# Altium schematic sheet SMARC Pinout-3.SchDoc
size A4; SheetNumber: 7; SheetTotal: 10
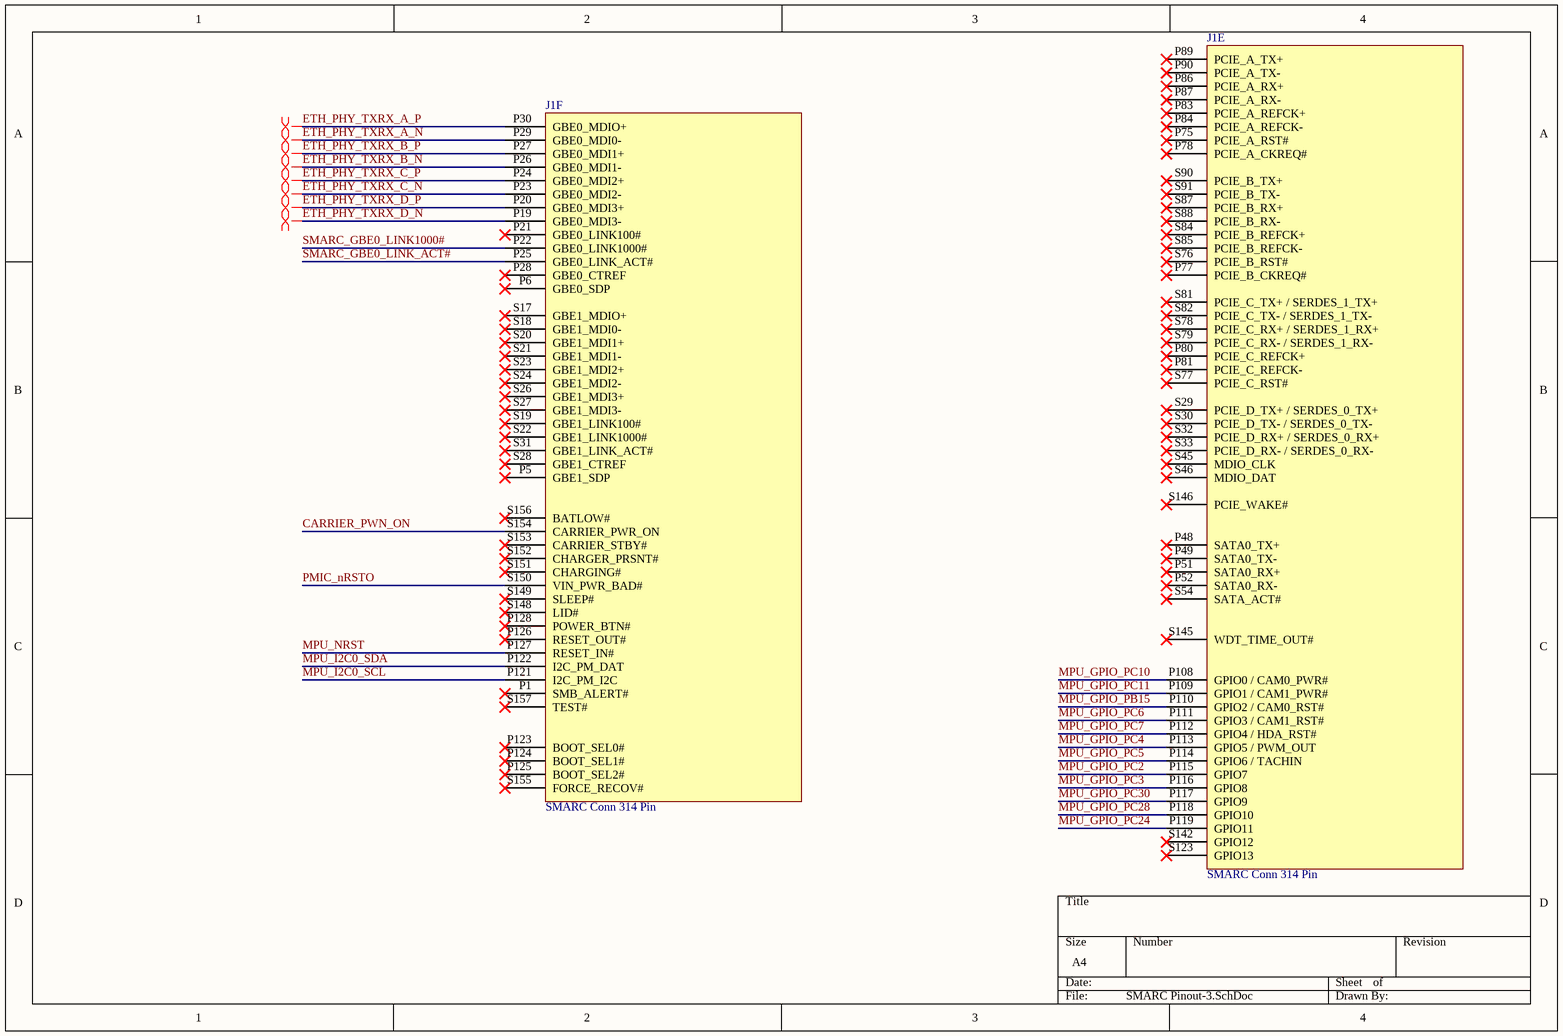
[diagram p0: SMARC Pinout-3.SchDoc]

## Parts
J1  SMARC Conn 314 Pin  [SMARC Conn 314 Pin]  (parts E,F of 6)

## Nets
CARRIER_PWN_ON: J1.S154(CARRIER_PWR_ON)
ETH_PHY_TXRX_A_N: J1.P29(GBE0_MDI0-)
ETH_PHY_TXRX_A_P: J1.P30(GBE0_MDIO+)
ETH_PHY_TXRX_B_N: J1.P26(GBE0_MDI1-)
ETH_PHY_TXRX_B_P: J1.P27(GBE0_MDI1+)
ETH_PHY_TXRX_C_N: J1.P23(GBE0_MDI2-)
ETH_PHY_TXRX_C_P: J1.P24(GBE0_MDI2+)
ETH_PHY_TXRX_D_N: J1.P19(GBE0_MDI3-)
ETH_PHY_TXRX_D_P: J1.P20(GBE0_MDI3+)
MPU_GPIO_PB15: J1.P110(GPIO2_/_CAM0_RST#)
MPU_GPIO_PC2: J1.P115(GPIO7)
MPU_GPIO_PC3: J1.P116(GPIO8)
MPU_GPIO_PC4: J1.P113(GPIO5_/_PWM_OUT)
MPU_GPIO_PC5: J1.P114(GPIO6_/_TACHIN)
MPU_GPIO_PC6: J1.P111(GPIO3_/_CAM1_RST#)
MPU_GPIO_PC7: J1.P112(GPIO4_/_HDA_RST#)
MPU_GPIO_PC10: J1.P108(GPIO0_/_CAM0_PWR#)
MPU_GPIO_PC11: J1.P109(GPIO1_/_CAM1_PWR#)
MPU_GPIO_PC24: J1.P119(GPIO11)
MPU_GPIO_PC28: J1.P118(GPIO10)
MPU_GPIO_PC30: J1.P117(GPIO9)
MPU_I2C0_SCL: J1.P121(I2C_PM_I2C)
MPU_I2C0_SDA: J1.P122(I2C_PM_DAT)
MPU_NRST: J1.P127(RESET_IN#)
PMIC_nRSTO: J1.S150(VIN_PWR_BAD#)
SMARC_GBE0_LINK1000#: J1.P22(GBE0_LINK1000#)
SMARC_GBE0_LINK_ACT#: J1.P25(GBE0_LINK_ACT#)

Not connected (* = marked no-connect by the designer): J1 P1(SMB_ALERT#)* P5(GBE1_SDP)* P6(GBE0_SDP)* P21(GBE0_LINK100#)* P28(GBE0_CTREF)* P48(SATA0_TX+)* P49(SATA0_TX-)* P51(SATA0_RX+)* P52(SATA0_RX-)* P75(PCIE_A_RST#)* P77(PCIE_B_CKREQ#)* P78(PCIE_A_CKREQ#)* P80(PCIE_C_REFCK+)* P81(PCIE_C_REFCK-)* P83(PCIE_A_REFCK+)* P84(PCIE_A_REFCK-)* P86(PCIE_A_RX+)* P87(PCIE_A_RX-)* P89(PCIE_A_TX+)* P90(PCIE_A_TX-)* P123(BOOT_SEL0#)* P124(BOOT_SEL1#)* P125(BOOT_SEL2#)* P126(RESET_OUT#)* P128(POWER_BTN#)* S17(GBE1_MDIO+)* S18(GBE1_MDI0-)* S19(GBE1_LINK100#)* S20(GBE1_MDI1+)* S21(GBE1_MDI1-)* S22(GBE1_LINK1000#)* S23(GBE1_MDI2+)* S24(GBE1_MDI2-)* S26(GBE1_MDI3+)* S27(GBE1_MDI3-)* S28(GBE1_CTREF)* S29(PCIE_D_TX+_/_SERDES_0_TX+)* S30(PCIE_D_TX-_/_SERDES_0_TX-)* S31(GBE1_LINK_ACT#)* S32(PCIE_D_RX+_/_SERDES_0_RX+)* S33(PCIE_D_RX-_/_SERDES_0_RX-)* S45(MDIO_CLK)* S46(MDIO_DAT)* S54(SATA_ACT#)* S76(PCIE_B_RST#)* S77(PCIE_C_RST#)* S78(PCIE_C_RX+_/_SERDES_1_RX+)* S79(PCIE_C_RX-_/_SERDES_1_RX-)* S81(PCIE_C_TX+_/_SERDES_1_TX+)* S82(PCIE_C_TX-_/_SERDES_1_TX-)* S84(PCIE_B_REFCK+)* S85(PCIE_B_REFCK-)* S87(PCIE_B_RX+)* S88(PCIE_B_RX-)* S90(PCIE_B_TX+)* S91(PCIE_B_TX-)* S123(GPIO13)* S142(GPIO12)* S145(WDT_TIME_OUT#)* S146(PCIE_WAKE#)* S148(LID#)* S149(SLEEP#)* S151(CHARGING#)* S152(CHARGER_PRSNT#)* S153(CARRIER_STBY#)* S155(FORCE_RECOV#)* S156(BATLOW#)* S157(TEST#)*

## Layout directives
differential pair: ETH_PHY_TXRX_A_N, ETH_PHY_TXRX_A_P, ETH_PHY_TXRX_B_N, ETH_PHY_TXRX_B_P, ETH_PHY_TXRX_C_N, ETH_PHY_TXRX_C_P, ETH_PHY_TXRX_D_N, ETH_PHY_TXRX_D_P